# Altium schematic sheet HLK_RM60_KIT_RJ45_V1.1.SchDoc
size A3
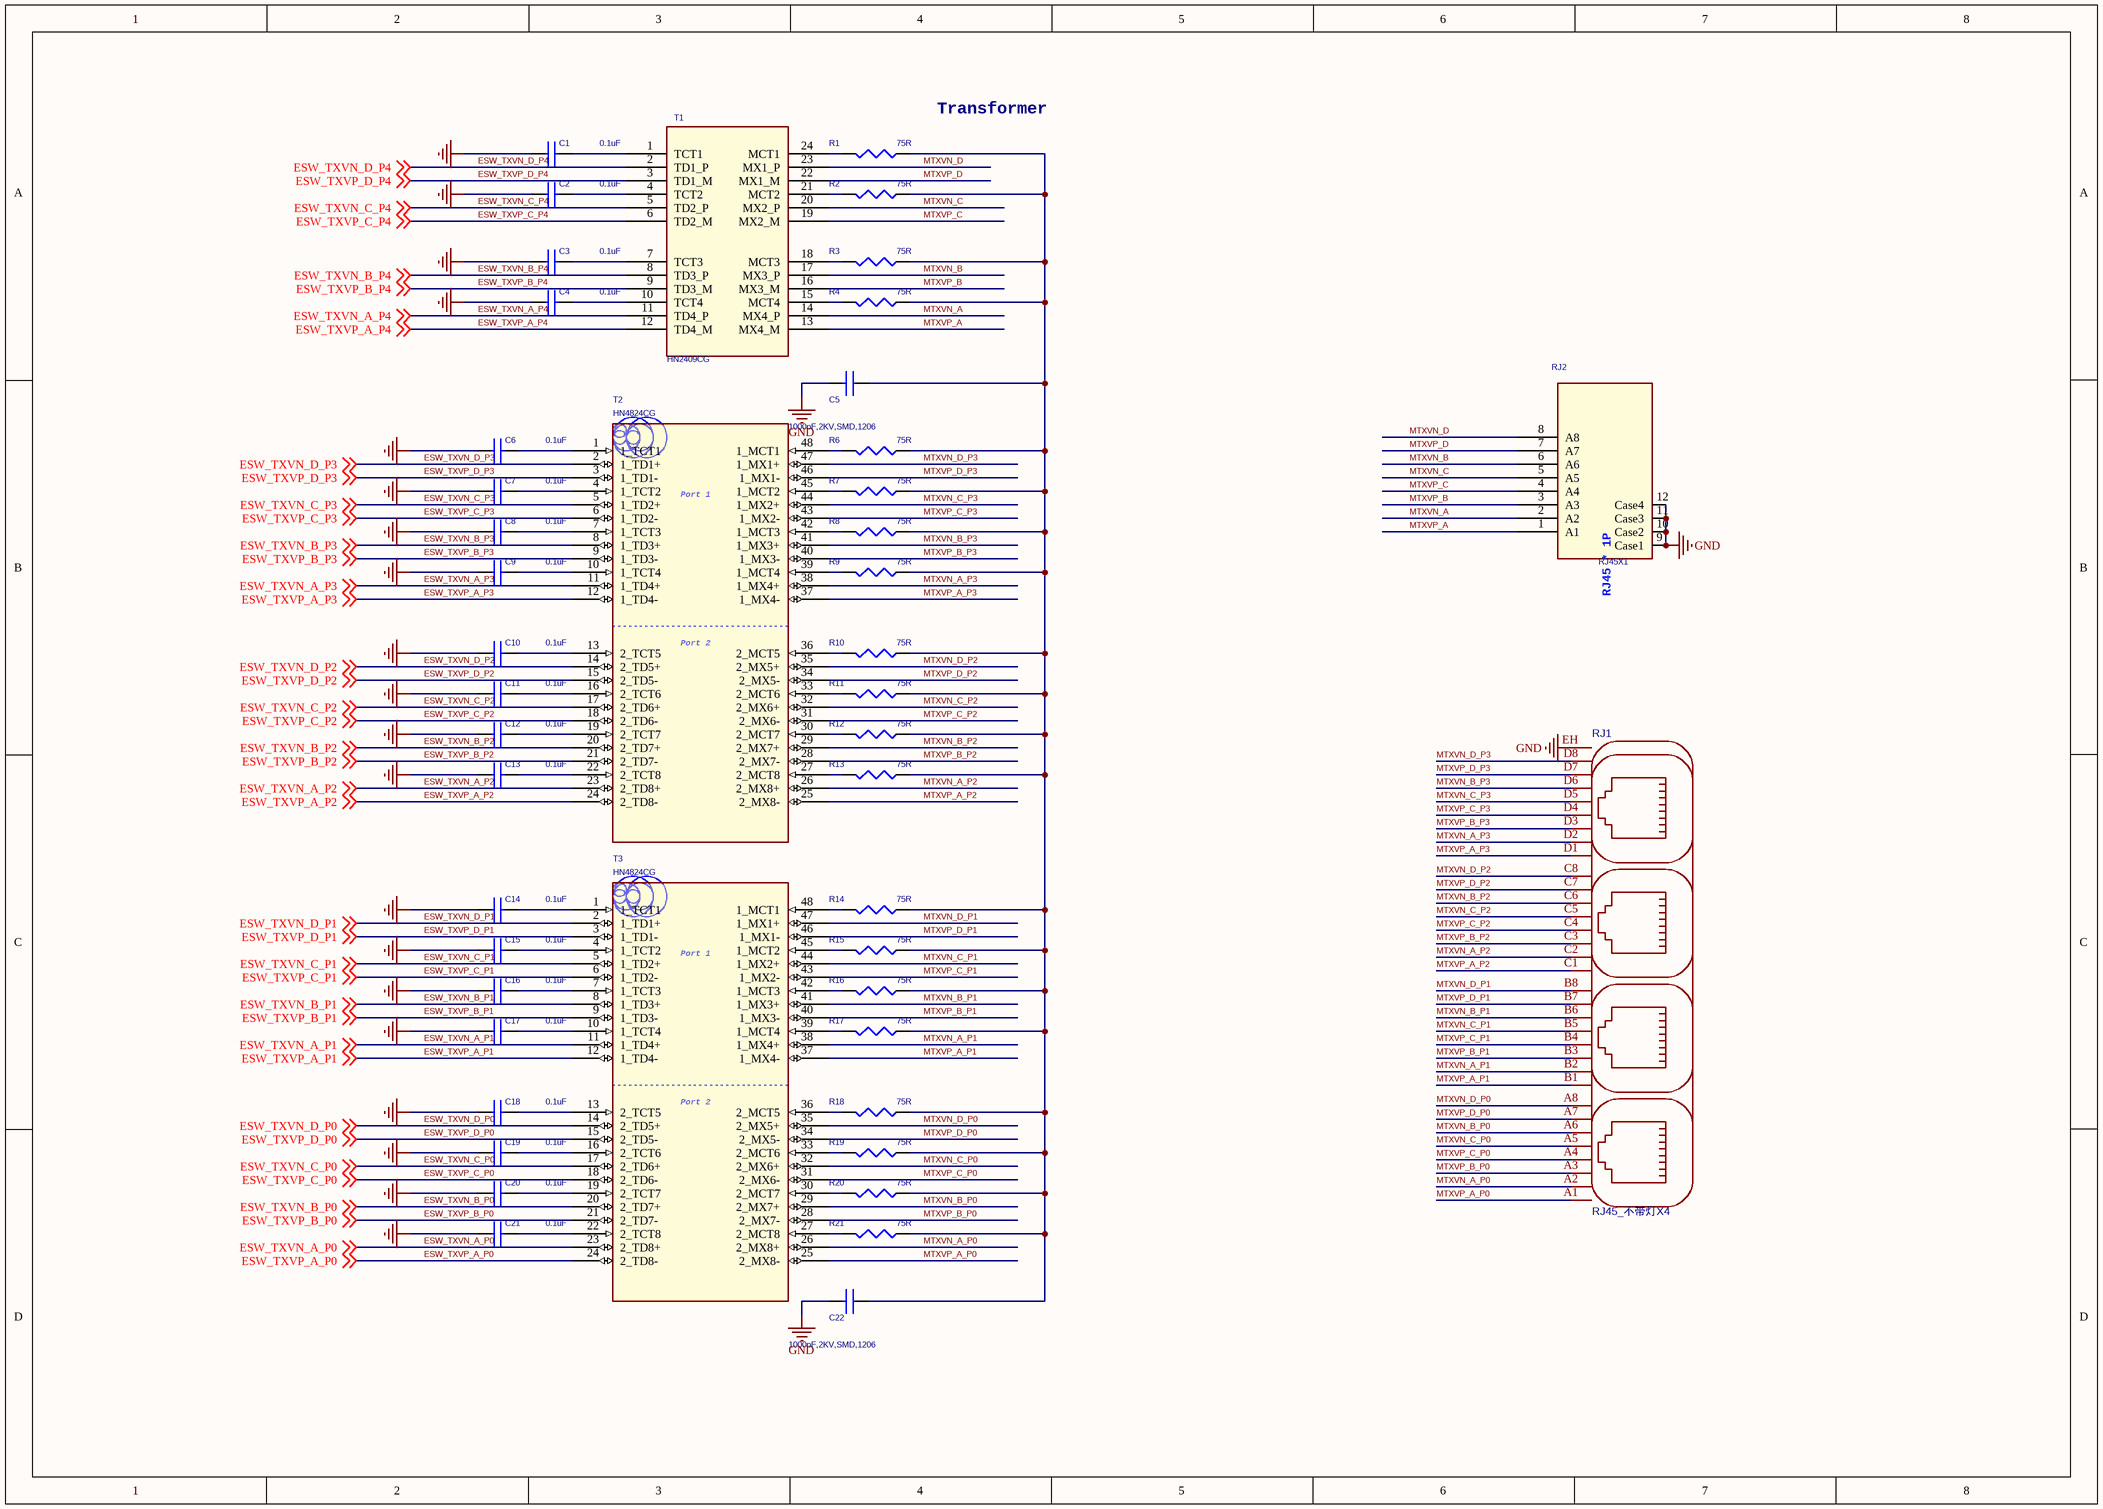
[diagram p0: HLK_RM60_KIT_RJ45_V1.1.SchDoc]

## Parts
C1  0.1uF  [C0402]
C2  0.1uF  [C0402]
C3  0.1uF  [C0402]
C4  0.1uF  [C0402]
C5  1000pF,2KV,SMD,1206  [C1206]
C6  0.1uF  [C0402]
C7  0.1uF  [C0402]
C8  0.1uF  [C0402]
C9  0.1uF  [C0402]
C10  0.1uF  [C0402]
C11  0.1uF  [C0402]
C12  0.1uF  [C0402]
C13  0.1uF  [C0402]
C14  0.1uF  [C0402]
C15  0.1uF  [C0402]
C16  0.1uF  [C0402]
C17  0.1uF  [C0402]
C18  0.1uF  [C0402]
C19  0.1uF  [C0402]
C20  0.1uF  [C0402]
C21  0.1uF  [C0402]
C22  1000pF,2KV,SMD,1206  [C1206]
R1  75R  [R0402]
R2  75R  [R0402]
R3  75R  [R0402]
R4  75R  [R0402]
R6  75R  [R0402]
R7  75R  [R0402]
R8  75R  [R0402]
R9  75R  [R0402]
R10  75R  [R0402]
R11  75R  [R0402]
R12  75R  [R0402]
R13  75R  [R0402]
R14  75R  [R0402]
R15  75R  [R0402]
R16  75R  [R0402]
R17  75R  [R0402]
R18  75R  [R0402]
R19  75R  [R0402]
R20  75R  [R0402]
R21  75R  [R0402]
RJ1  RJ45_不带灯X4  [RJ45_网口不带灯X4]
RJ2  RJ45X1  [RJ45_网口不带灯X1]
T1  HN2409CG  [TRANSFORMER/24P/SMD/HN2429CG]
T2  HN4824CG  [TRANSFORMER/48P/SMD/GS5014LF]
T3  HN4824CG  [TRANSFORMER/48P/SMD/GS5014LF]

## Nets
GND: C1.1 C2.1 C3.1 C4.1 C5.2 C6.1 C7.1 C8.1 C9.1 C10.1 C11.1 C12.1 C13.1 C14.1 C15.1 C16.1 C17.1 C18.1 C19.1 C20.1 C21.1 C22.2 RJ1.EH RJ2.9(Case1) RJ2.10(Case2) RJ2.11(Case3) RJ2.12(Case4)
ESW_TXVN_A_P0: T3.23(2_TD8+) ; off-sheet ESW_TXVN_A_P0
ESW_TXVN_A_P1: T3.11(1_TD4+) ; off-sheet ESW_TXVN_A_P1
ESW_TXVN_A_P2: T2.23(2_TD8+) ; off-sheet ESW_TXVN_A_P2
ESW_TXVN_A_P3: T2.11(1_TD4+) ; off-sheet ESW_TXVN_A_P3
ESW_TXVN_A_P4: T1.11(TD4_P) ; off-sheet ESW_TXVN_A_P4
ESW_TXVN_B_P0: T3.20(2_TD7+) ; off-sheet ESW_TXVN_B_P0
ESW_TXVN_B_P1: T3.8(1_TD3+) ; off-sheet ESW_TXVN_B_P1
ESW_TXVN_B_P2: T2.20(2_TD7+) ; off-sheet ESW_TXVN_B_P2
ESW_TXVN_B_P3: T2.8(1_TD3+) ; off-sheet ESW_TXVN_B_P3
ESW_TXVN_B_P4: T1.8(TD3_P) ; off-sheet ESW_TXVN_B_P4
ESW_TXVN_C_P0: T3.17(2_TD6+) ; off-sheet ESW_TXVN_C_P0
ESW_TXVN_C_P1: T3.5(1_TD2+) ; off-sheet ESW_TXVN_C_P1
ESW_TXVN_C_P2: T2.17(2_TD6+) ; off-sheet ESW_TXVN_C_P2
ESW_TXVN_C_P3: T2.5(1_TD2+) ; off-sheet ESW_TXVN_C_P3
ESW_TXVN_C_P4: T1.5(TD2_P) ; off-sheet ESW_TXVN_C_P4
ESW_TXVN_D_P0: T3.14(2_TD5+) ; off-sheet ESW_TXVN_D_P0
ESW_TXVN_D_P1: T3.2(1_TD1+) ; off-sheet ESW_TXVN_D_P1
ESW_TXVN_D_P2: T2.14(2_TD5+) ; off-sheet ESW_TXVN_D_P2
ESW_TXVN_D_P3: T2.2(1_TD1+) ; off-sheet ESW_TXVN_D_P3
ESW_TXVN_D_P4: T1.2(TD1_P) ; off-sheet ESW_TXVN_D_P4
ESW_TXVP_A_P0: T3.24(2_TD8-) ; off-sheet ESW_TXVP_A_P0
ESW_TXVP_A_P1: T3.12(1_TD4-) ; off-sheet ESW_TXVP_A_P1
ESW_TXVP_A_P2: T2.24(2_TD8-) ; off-sheet ESW_TXVP_A_P2
ESW_TXVP_A_P3: T2.12(1_TD4-) ; off-sheet ESW_TXVP_A_P3
ESW_TXVP_A_P4: T1.12(TD4_M) ; off-sheet ESW_TXVP_A_P4
ESW_TXVP_B_P0: T3.21(2_TD7-) ; off-sheet ESW_TXVP_B_P0
ESW_TXVP_B_P1: T3.9(1_TD3-) ; off-sheet ESW_TXVP_B_P1
ESW_TXVP_B_P2: T2.21(2_TD7-) ; off-sheet ESW_TXVP_B_P2
ESW_TXVP_B_P3: T2.9(1_TD3-) ; off-sheet ESW_TXVP_B_P3
ESW_TXVP_B_P4: T1.9(TD3_M) ; off-sheet ESW_TXVP_B_P4
ESW_TXVP_C_P0: T3.18(2_TD6-) ; off-sheet ESW_TXVP_C_P0
ESW_TXVP_C_P1: T3.6(1_TD2-) ; off-sheet ESW_TXVP_C_P1
ESW_TXVP_C_P2: T2.18(2_TD6-) ; off-sheet ESW_TXVP_C_P2
ESW_TXVP_C_P3: T2.6(1_TD2-) ; off-sheet ESW_TXVP_C_P3
ESW_TXVP_C_P4: T1.6(TD2_M) ; off-sheet ESW_TXVP_C_P4
ESW_TXVP_D_P0: T3.15(2_TD5-) ; off-sheet ESW_TXVP_D_P0
ESW_TXVP_D_P1: T3.3(1_TD1-) ; off-sheet ESW_TXVP_D_P1
ESW_TXVP_D_P2: T2.15(2_TD5-) ; off-sheet ESW_TXVP_D_P2
ESW_TXVP_D_P3: T2.3(1_TD1-) ; off-sheet ESW_TXVP_D_P3
ESW_TXVP_D_P4: T1.3(TD1_M) ; off-sheet ESW_TXVP_D_P4
MTXVN_A: RJ2.2(A2) T1.14(MX4_P)
MTXVN_A_P0: RJ1.A2 T3.26(2_MX8+)
MTXVN_A_P1: RJ1.B2 T3.38(1_MX4+)
MTXVN_A_P2: RJ1.C2 T2.26(2_MX8+)
MTXVN_A_P3: RJ1.D2 T2.38(1_MX4+)
MTXVN_B: RJ2.6(A6) T1.17(MX3_P)
MTXVN_B_P0: RJ1.A6 T3.29(2_MX7+)
MTXVN_B_P1: RJ1.B6 T3.41(1_MX3+)
MTXVN_B_P2: RJ1.C6 T2.29(2_MX7+)
MTXVN_B_P3: RJ1.D6 T2.41(1_MX3+)
MTXVN_C: RJ2.5(A5) T1.20(MX2_P)
MTXVN_C_P0: RJ1.A5 T3.32(2_MX6+)
MTXVN_C_P1: RJ1.B5 T3.44(1_MX2+)
MTXVN_C_P2: RJ1.C5 T2.32(2_MX6+)
MTXVN_C_P3: RJ1.D5 T2.44(1_MX2+)
MTXVN_D: RJ2.8(A8) T1.23(MX1_P)
MTXVN_D_P0: RJ1.A8 T3.35(2_MX5+)
MTXVN_D_P1: RJ1.B8 T3.47(1_MX1+)
MTXVN_D_P2: RJ1.C8 T2.35(2_MX5+)
MTXVN_D_P3: RJ1.D8 T2.47(1_MX1+)
MTXVP_A: RJ2.1(A1) T1.13(MX4_M)
MTXVP_A_P0: RJ1.A1 T3.25(2_MX8-)
MTXVP_A_P1: RJ1.B1 T3.37(1_MX4-)
MTXVP_A_P2: RJ1.C1 T2.25(2_MX8-)
MTXVP_A_P3: RJ1.D1 T2.37(1_MX4-)
MTXVP_B: RJ2.3(A3) T1.16(MX3_M)
MTXVP_B_P0: RJ1.A3 T3.28(2_MX7-)
MTXVP_B_P1: RJ1.B3 T3.40(1_MX3-)
MTXVP_B_P2: RJ1.C3 T2.28(2_MX7-)
MTXVP_B_P3: RJ1.D3 T2.40(1_MX3-)
MTXVP_C: RJ2.4(A4) T1.19(MX2_M)
MTXVP_C_P0: RJ1.A4 T3.31(2_MX6-)
MTXVP_C_P1: RJ1.B4 T3.43(1_MX2-)
MTXVP_C_P2: RJ1.C4 T2.31(2_MX6-)
MTXVP_C_P3: RJ1.D4 T2.43(1_MX2-)
MTXVP_D: RJ2.7(A7) T1.22(MX1_M)
MTXVP_D_P0: RJ1.A7 T3.34(2_MX5-)
MTXVP_D_P1: RJ1.B7 T3.46(1_MX1-)
MTXVP_D_P2: RJ1.C7 T2.34(2_MX5-)
MTXVP_D_P3: RJ1.D7 T2.46(1_MX1-)
NetC1_2: C1.2 T1.1(TCT1)
NetC2_2: C2.2 T1.4(TCT2)
NetC3_2: C3.2 T1.7(TCT3)
NetC4_2: C4.2 T1.10(TCT4)
NetC5_1: C5.1 C22.1 R1.1 R2.1 R3.1 R4.1 R6.1 R7.1 R8.1 R9.1 R10.1 R11.1 R12.1 R13.1 R14.1 R15.1 R16.1 R17.1 R18.1 R19.1 R20.1 R21.1
NetC6_2: C6.2 T2.1(1_TCT1)
NetC7_2: C7.2 T2.4(1_TCT2)
NetC8_2: C8.2 T2.7(1_TCT3)
NetC9_2: C9.2 T2.10(1_TCT4)
NetC10_2: C10.2 T2.13(2_TCT5)
NetC11_2: C11.2 T2.16(2_TCT6)
NetC12_2: C12.2 T2.19(2_TCT7)
NetC13_2: C13.2 T2.22(2_TCT8)
NetC14_2: C14.2 T3.1(1_TCT1)
NetC15_2: C15.2 T3.4(1_TCT2)
NetC16_2: C16.2 T3.7(1_TCT3)
NetC17_2: C17.2 T3.10(1_TCT4)
NetC18_2: C18.2 T3.13(2_TCT5)
NetC19_2: C19.2 T3.16(2_TCT6)
NetC20_2: C20.2 T3.19(2_TCT7)
NetC21_2: C21.2 T3.22(2_TCT8)
NetR1_2: R1.2 T1.24(MCT1)
NetR2_2: R2.2 T1.21(MCT2)
NetR3_2: R3.2 T1.18(MCT3)
NetR4_2: R4.2 T1.15(MCT4)
NetR6_2: R6.2 T2.48(1_MCT1)
NetR7_2: R7.2 T2.45(1_MCT2)
NetR8_2: R8.2 T2.42(1_MCT3)
NetR9_2: R9.2 T2.39(1_MCT4)
NetR10_2: R10.2 T2.36(2_MCT5)
NetR11_2: R11.2 T2.33(2_MCT6)
NetR12_2: R12.2 T2.30(2_MCT7)
NetR13_2: R13.2 T2.27(2_MCT8)
NetR14_2: R14.2 T3.48(1_MCT1)
NetR15_2: R15.2 T3.45(1_MCT2)
NetR16_2: R16.2 T3.42(1_MCT3)
NetR17_2: R17.2 T3.39(1_MCT4)
NetR18_2: R18.2 T3.36(2_MCT5)
NetR19_2: R19.2 T3.33(2_MCT6)
NetR20_2: R20.2 T3.30(2_MCT7)
NetR21_2: R21.2 T3.27(2_MCT8)

## Notes on the sheet
- (near R1) Transformer
- (in symbol RJ45X1_4) RJ45 * 1P
- (in symbol XMER 2P G2PM109N) Port 1; Port 2

## Library data of the parts
C1-C4 C10-C15 C18 C19 = 0.1UF/25V_+80%-20%_CC_S0603: Cap, MLCC, 0402, Y5V, 16V; Manufacturer: 地穝; Part Number: 100-110-03400; V1: 25V +80% -20%; P/N: 26-400-311104; Class: 0C-0402; Key: 3162U-N14-V11-#478; BOM_Class: RJ45; HYP_Type: (C; By: Ralink; Package: SMD; Distributor_FAX: 02-2917-3336~7; Distributor_TEL: 02-2917-3334; Distributor_Mobile: 0939-969-849; Distributor_Name: 糂╭; Distributor: 瓁穨; Package_Type: Reel
C5 C22 = CAP NP_Dup1: Cap, HighVolt, SMD 1206, 2KV; Manufacturer: Arcotromics; Class: 0C-HighVolt; Key: 3162U-N14-V11-#409; BOM_Class: RJ45; HYP_Type: (C; By: Ralink; Price_USD: 0.02; Price: 0.66; Package_Type: 床杆; Package: DIP; Distributor: 窲瓣悔; Distributor_Name: 羘縈; Distributor_Name2: Alven; Distributor_Mobile: 0933-153488; Distributor_TEL: 02-2999-6599 #163; Distributor_FAX: 02-2999-6614
C6-C9 C16 C17 C20 C21 = 0.1UF/25V_+80%-20%_CC_S0603: Cap, MLCC, 0402, Y5V, 16V; Part Number: 100-110-03400; Manufacturer: 地穝; V1: 25V +80% -20%; P/N: 26-400-311104; By: Ralink; HYP_Type: (C; BOM_Class: RJ45; Key: 3162U-N14-V11-#478; Class: 0C-0402; Package: SMD; Package_Type: Reel; Distributor: 瓁穨; Distributor_Name: 糂╭; Distributor_Mobile: 0939-969-849; Distributor_TEL: 02-2917-3334; Distributor_FAX: 02-2917-3336~7
R1 R2 = R75_1%_S0603: Resistor, 0402, 5%; Manufacturer: 驾м; Part Number: 110-110-03300; V1: 1% 1/16W; P/N: 21-201-627501; SDTSourceLibName: C:\WINDOWS\TEMP\DEVICE1.LIB; HYP_Type: (R; BOM_Class: RJ45; By: Ralink; Key: 3162U-N14-V11-#345; Class: 1R-0402; Package: SMD; Distributor_FAX: 03-3245183 ,3247410; Distributor_TEL: 03-3246169 #2221; Distributor_Name2: Cherry Yang; Distributor_Name: 法睶骸; Distributor: 驾м; Price: 0.0099; Package_Type: Reel; Price_USD: 0.0003; Distributor_Mobile: NA
R3 = R75_1%_S0603: Resistor, 0402, 5%; Manufacturer: 驾м; Part Number: 110-110-03300; V1: 1% 1/16W; P/N: 21-201-627501; SDTSourceLibName: C:\WINDOWS\TEMP\DEVICE1.LIB; By: Ralink; BOM_Class: RJ45; HYP_Type: (R; Key: 3162U-N14-V11-#345; Class: 1R-0402; Package: SMD; Distributor_FAX: 03-3245183 ,3247410; Distributor_TEL: 03-3246169 #2221; Distributor_Name2: Cherry Yang; Distributor_Name: 法睶骸; Distributor: 驾м; Package_Type: Reel; Price: 0.0099; Price_USD: 0.0003; Distributor_Mobile: NA
R4 = R75_1%_S0603: Resistor, 0402, 5%; Part Number: 110-110-03300; Manufacturer: 驾м; V1: 1% 1/16W; P/N: 21-201-627501; SDTSourceLibName: C:\WINDOWS\TEMP\DEVICE1.LIB; Class: 1R-0402; Key: 3162U-N14-V11-#345; HYP_Type: (R; BOM_Class: RJ45; By: Ralink; Package: SMD; Distributor_Mobile: NA; Price_USD: 0.0003; Price: 0.0099; Package_Type: Reel; Distributor: 驾м; Distributor_Name: 法睶骸; Distributor_Name2: Cherry Yang; Distributor_TEL: 03-3246169 #2221; Distributor_FAX: 03-3245183 ,3247410
R6 R9 R12 R17-R19 R21 = R75_1%_S0603: Resistor, SMD 0402, 5%; Manufacturer: 驾м; Part Number: 110-110-03300; V1: 5% 1/4W; P/N: 21-201-627501; SDTSourceLibName: C:\WINDOWS\TEMP\SCH.LIB; By: Ralink; BOM_Class: RJ45; HYP_Type: (R; Key: 3162U-N14-V11-#345; Class: 1R-0402; Package: SMD; Distributor_FAX: 03-3245183 ,3247410; Distributor_TEL: 03-3246169 #2221; Distributor_Name2: Cherry Yang; Distributor_Name: 法睶骸; Distributor: 驾м; Package_Type: Reel; Distributor_Mobile: NA
R7 R8 R10 R11 R13-R16 R20 = R75_1%_S0603: Resistor, SMD 0402, 5%; Part Number: 110-110-03300; Manufacturer: 驾м; V1: 5% 1/4W; P/N: 21-201-627501; SDTSourceLibName: C:\WINDOWS\TEMP\SCH.LIB; Class: 1R-0402; Key: 3162U-N14-V11-#345; HYP_Type: (R; BOM_Class: RJ45; By: Ralink; Package: SMD; Distributor_Mobile: NA; Package_Type: Reel; Distributor: 驾м; Distributor_Name: 法睶骸; Distributor_Name2: Cherry Yang; Distributor_TEL: 03-3246169 #2221; Distributor_FAX: 03-3245183 ,3247410
RJ1 = RJ45_不带灯X4: BOM_Manufacturer: CONNFLY; BOM_Manufacturer Part: DS1129-02-S80BP; subpart_no: 3; BOM_Supplier Part: C77852; BOM_Supplier: LCSC; image: http://image.lceda.cn/szlcsc/C77852.jpg; spicePre: R; spiceSymbolName: DS1129-02-S80BP
RJ2 = RJ45X1_4: Manufacturer: 救┹; Manufacturer's Part Number: PJ-A1-BXBH-FDNNN-1; Part Number: 214411*12311105
T1 = FT20-252B_2
T2 T3 = XMER 2P G2PM109N